# Altium project NFC-Reader.PrjPcb (part 7 of 11)
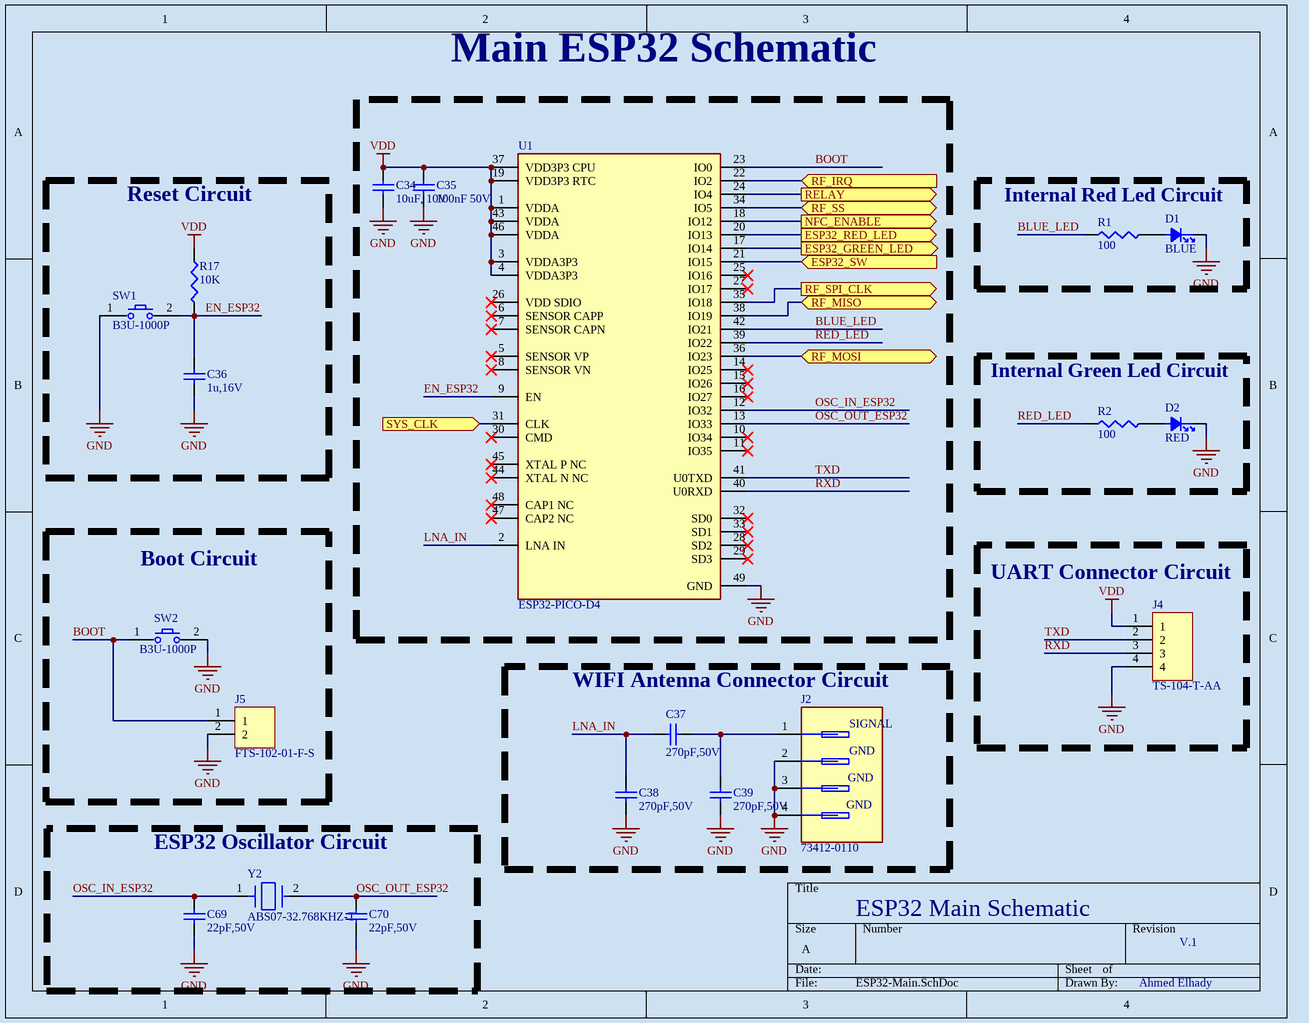
[diagram p10: ESP32-Main.SchDoc]

## Sheet ESP32-Main.SchDoc (continued)

### Library data of the parts (continued)
R1 R2 = CRCW0603100RFKEA: 100 Ohms ±1% 0.125W, 1/8W Chip Resistor 0603 (1608 Metric) Automotive AEC-Q200 Thick Film; Manufacturer: Vishay; Max Power Dissipation: 100mW; Value: 100Ω; Temperature Coefficient: 100ppm/°C; Voltage Rating: 75V; Supplier: DigiKey; Manufacturer Part Number: CRCW0603100RFKEA; RoHS: Compliant; Category: Chip SMD Resistors; Stock: 486492; Pricing: 1=0.1, 10=0.03, 25=0.0224, 50=0.0182, 100=0.015, 250=0.01172, 500=0.0099, 1000=0.00845 (USD); Case/Package: 0603; Case Code (Imperial): 0603; China RoHS: Non-Compliant; Composition: Thick Film; Contact Plating: Tin; Depth: 850µm; Features: Automotive AEC-Q200; Height: 450µm; Lead Free: Lead Free; Length: 1.55mm; Lifecycle Status: Production; Max Operating Temperature: 155°C; Military Standard: Not; Min Operating Temperature: -55°C; Mounting Technology: Surface Mount; Pins: 2; Number of Terminals: 2; Number of Terminations: 2; Packaging: Cut Tape; Power Dissipation: 100mW; Power Rating: 100mW; Radiation Hardening: No; REACH SVHC: Yes; Schedule B: 8533210045; Termination: SMD/SMT; Tolerance: 1%; Voltage Rating (DC): 75V; Weight: 2.012816mg; Width: 850µm; Working Voltage: 75V; ComponentLink1URL: https://datasheet.octopart.com:443/CRCW0603100RFKEA-Vishay-datasheet-175423584.pdf?src-supplier=Newark; ComponentLink1Description: https://datasheet.octopart.com:443/CRCW0603100RFKEA-Vishay-datasheet-175423584.pdf?src-supplier=Newark; ComponentLink2URL: https://datasheet.octopart.com:443/CRCW0603100RFKEA-Vishay-datasheet-14722531.pdf?src-supplier=Newark; ComponentLink2Description: https://datasheet.octopart.com:443/CRCW0603100RFKEA-Vishay-datasheet-14722531.pdf?src-supplier=Newark; ComponentLink3URL: https://datasheet.octopart.com:443/CRCW0603100RFKEA-Vishay-datasheet-11516975.pdf?src-supplier=Newark; ComponentLink3Description: https://datasheet.octopart.com:443/CRCW0603100RFKEA-Vishay-datasheet-11516975.pdf?src-supplier=Newark; ComponentLink4URL: https://datasheet.octopart.com:443/CRCW0603100RFKEA-Vishay-datasheet-41302739.pdf?src-supplier=Newark; ComponentLink4Description: https://datasheet.octopart.com:443/CRCW0603100RFKEA-Vishay-datasheet-41302739.pdf?src-supplier=Newark; ComponentLink5URL: https://datasheet.octopart.com:443/CRCW0603100RFKEA-Vishay-datasheet-33013972.pdf?src-supplier=Newark; ComponentLink5Description: https://datasheet.octopart.com:443/CRCW0603100RFKEA-Vishay-datasheet-33013972.pdf?src-supplier=Newark; ComponentLink6URL: https://datasheet.octopart.com:443/CRCW0603100RFKEA-Vishay-datasheet-21226360.pdf?src-supplier=Newark; ComponentLink6Description: https://datasheet.octopart.com:443/CRCW0603100RFKEA-Vishay-datasheet-21226360.pdf?src-supplier=Newark; ComponentLink7URL: https://datasheet.octopart.com:443/CRCW0603100RFKEA-Vishay-datasheet-62316122.pdf?src-supplier=Future+Electronics; ComponentLink7Description: https://datasheet.octopart.com:443/CRCW0603100RFKEA-Vishay-datasheet-62316122.pdf?src-supplier=Future+Electronics; ComponentLink8URL: https://datasheet.octopart.com:443/CRCW0603100RFKEA-Vishay-datasheet-5300368.pdf?src-supplier=Future+Electronics; ComponentLink8Description: https://datasheet.octopart.com:443/CRCW0603100RFKEA-Vishay-datasheet-5300368.pdf?src-supplier=Future+Electronics; ComponentLink9URL: https://datasheet.octopart.com:443/CRCW0603100RFKEA-Vishay-datasheet-83961561.pdf?src-supplier=element14+APAC; ComponentLink9Description: https://datasheet.octopart.com:443/CRCW0603100RFKEA-Vishay-datasheet-83961561.pdf?src-supplier=element14+APAC; ComponentLink10URL: https://datasheet.octopart.com:443/CRCW0603100RFKEA-Vishay-datasheet-62317933.pdf?src-supplier=element14+APAC; ComponentLink10Description: https://datasheet.octopart.com:443/CRCW0603100RFKEA-Vishay-datasheet-62317933.pdf?src-supplier=element14+APAC; ComponentLink11URL: https://datasheet.octopart.com:443/CRCW0603100RFKEA-Vishay-datasheet-16179825.pdf?src-supplier=element14+APAC; ComponentLink11Description: https://datasheet.octopart.com:443/CRCW0603100RFKEA-Vishay-datasheet-16179825.pdf?src-supplier=element14+APAC; ComponentLink12URL: https://datasheet.octopart.com:443/CRCW0603100RFKEA-Vishay-datasheet-66077789.pdf?src-supplier=element14+APAC; ComponentLink12Description: https://datasheet.octopart.com:443/CRCW0603100RFKEA-Vishay-datasheet-66077789.pdf?src-supplier=element14+APAC; ComponentLink13URL: https://datasheet.octopart.com:443/CRCW0603100RFKEA-Vishay-datasheet-5306405.pdf?src-supplier=RS+(Formerly+Allied+Electronics); ComponentLink13Description: https://datasheet.octopart.com:443/CRCW0603100RFKEA-Vishay-datasheet-5306405.pdf?src-supplier=RS+(Formerly+Allied+Electronics); ComponentLink14URL: https://datasheet.octopart.com:443/CRCW0603100RFKEA-Vishay-Dale-datasheet-47688880.pdf?src-supplier=RS+(Formerly+Allied+Electronics); ComponentLink14Description: https://datasheet.octopart.com:443/CRCW0603100RFKEA-Vishay-Dale-datasheet-47688880.pdf?src-supplier=RS+(Formerly+Allied+Electronics); ComponentLink15URL: https://datasheet.octopart.com:443/CRCW0603100RFKEA-Vishay-datasheet-12001583.pdf?src-supplier=RS+(Formerly+Allied+Electronics); ComponentLink15Description: https://datasheet.octopart.com:443/CRCW0603100RFKEA-Vishay-datasheet-12001583.pdf?src-supplier=RS+(Formerly+Allied+Electronics); ComponentLink16URL: https://datasheet.octopart.com:443/CRCW0603100RFKEA-Vishay-datasheet-137113732.pdf?src-supplier=X-ON; ComponentLink16Description: https://datasheet.octopart.com:443/CRCW0603100RFKEA-Vishay-datasheet-137113732.pdf?src-supplier=X-ON; ComponentLink17URL: https://datasheet.octopart.com:443/CRCW0603100RFKEA-Vishay-datasheet-17834126.pdf?src-supplier=TME; ComponentLink17Description: https://datasheet.octopart.com:443/CRCW0603100RFKEA-Vishay-datasheet-17834126.pdf?src-supplier=TME; ComponentLink18URL: https://datasheet.octopart.com/D-CRCW-e3-Standard-Thick-Film-Chip-Resistors-Vishay-datasheet-family-64.pdf; ComponentLink18Description: https://datasheet.octopart.com/D-CRCW-e3-Standard-Thick-Film-Chip-Resistors-Vishay-datasheet-family-64.pdf; ComponentLink19URL: https://datasheet.octopart.com:443/CRCW0603100RFKEA-Vishay-datasheet-13242068.pdf?src-supplier=Farnell; ComponentLink19Description: https://datasheet.octopart.com:443/CRCW0603100RFKEA-Vishay-datasheet-13242068.pdf?src-supplier=Farnell; ComponentLink20URL: https://datasheet.octopart.com:443/CRCW0603100RFKEA-Vishay-datasheet-13195083.pdf?src-supplier=Farnell; ComponentLink20Description: https://datasheet.octopart.com:443/CRCW0603100RFKEA-Vishay-datasheet-13195083.pdf?src-supplier=Farnell; ComponentLink21URL: https://datasheet.octopart.com:443/CRCW0603100RFKEA-Vishay-datasheet-13034211.pdf?src-supplier=Farnell; ComponentLink21Description: https://datasheet.octopart.com:443/CRCW0603100RFKEA-Vishay-datasheet-13034211.pdf?src-supplier=Farnell; ComponentLink22URL: https://datasheet.octopart.com:443/CRCW0603100RFKEA-Vishay-datasheet-12600034.pdf?src-supplier=Farnell; ComponentLink22Description: https://datasheet.octopart.com:443/CRCW0603100RFKEA-Vishay-datasheet-12600034.pdf?src-supplier=Farnell; ComponentLink23URL: https://datasheet.octopart.com:443/CRCW0603100RFKEA-Vishay-datasheet-12532161.pdf?src-supplier=Farnell; ComponentLink23Description: https://datasheet.octopart.com:443/CRCW0603100RFKEA-Vishay-datasheet-12532161.pdf?src-supplier=Farnell; ComponentLink24URL: https://datasheet.octopart.com:443/CRCW0603100RFKEA-Vishay-datasheet-12517896.pdf?src-supplier=Farnell; ComponentLink24Description: https://datasheet.octopart.com:443/CRCW0603100RFKEA-Vishay-datasheet-12517896.pdf?src-supplier=Farnell; ComponentLink25URL: https://datasheet.octopart.com:443/CRCW0603100RFKEA-Vishay-datasheet-12509762.pdf?src-supplier=Farnell; ComponentLink25Description: https://datasheet.octopart.com:443/CRCW0603100RFKEA-Vishay-datasheet-12509762.pdf?src-supplier=Farnell; ComponentLink26URL: https://datasheet.octopart.com:443/CRCW0603100RFKEA-Vishay-datasheet-10322335.pdf?src-supplier=Farnell; ComponentLink26Description: https://datasheet.octopart.com:443/CRCW0603100RFKEA-Vishay-datasheet-10322335.pdf?src-supplier=Farnell; ComponentLink27URL: https://datasheet.octopart.com:443/CRCW0603100RFKEA-Vishay-datasheet-8788789.pdf?src-supplier=Farnell; ComponentLink27Description: https://datasheet.octopart.com:443/CRCW0603100RFKEA-Vishay-datasheet-8788789.pdf?src-supplier=Farnell; ComponentLink28URL: https://datasheet.octopart.com:443/CRCW0603100RFKEA-Vishay-datasheet-8361388.pdf?src-supplier=Farnell; ComponentLink28Description: https://datasheet.octopart.com:443/CRCW0603100RFKEA-Vishay-datasheet-8361388.pdf?src-supplier=Farnell; ComponentLink29URL: https://datasheet.octopart.com:443/CRCW0603100RFKEA-Vishay-datasheet-546287.pdf?src-supplier=Farnell; ComponentLink29Description: https://datasheet.octopart.com:443/CRCW0603100RFKEA-Vishay-datasheet-546287.pdf?src-supplier=Farnell; ComponentLink30URL: https://datasheet.octopart.com:443/CRCW0603100RFKEA-Vishay-datasheet-11540273.pdf?src-supplier=Arrow+Electronics; ComponentLink30Description: https://datasheet.octopart.com:443/CRCW0603100RFKEA-Vishay-datasheet-11540273.pdf?src-supplier=Arrow+Electronics; ComponentLink31URL: https://datasheet.octopart.com:443/CRCW0603100RFKEA-Vishay-datasheet-8445837.pdf?src-supplier=element14; ComponentLink31Description: https://datasheet.octopart.com:443/CRCW0603100RFKEA-Vishay-datasheet-8445837.pdf?src-supplier=element14; ComponentLink32URL: https://datasheet.octopart.com:443/CRCW0603100RFKEA-Vishay-datasheet-5377433.pdf?src-supplier=Garrett; ComponentLink32Description: https://datasheet.octopart.com:443/CRCW0603100RFKEA-Vishay-datasheet-5377433.pdf?src-supplier=Garrett; ComponentLink33URL: https://datasheet.octopart.com:443/CRCW0603100RFKEA-Vishay-datasheet-148188.pdf?src-supplier=Garrett; ComponentLink33Description: https://datasheet.octopart.com:443/CRCW0603100RFKEA-Vishay-datasheet-148188.pdf?src-supplier=Garrett; ComponentLink34URL: https://datasheet.octopart.com:443/CRCW0603100RFKEA-Vishay-datasheet-30224.pdf?src-supplier=Garrett; ComponentLink34Description: https://datasheet.octopart.com:443/CRCW0603100RFKEA-Vishay-datasheet-30224.pdf?src-supplier=Garrett; ComponentLink35URL: http://sigma.octopart.com:80/rohs_certificate/D-CRCW-e3-Standard-Thick-Film-Chip-Resistors-Vishay-family-102.pdf?src-supplier=Compliance+Statements; ComponentLink35Description: http://sigma.octopart.com:80/rohs_certificate/D-CRCW-e3-Standard-Thick-Film-Chip-Resistors-Vishay-family-102.pdf?src-supplier=Compliance+Statements; LCSC PN: C844917
R17 = RC0603FR-0710KL: 10 kOhms ±1% 0.1W, 1/10W Chip Resistor 0603 (1608 Metric) Moisture Resistant Thick Film; Manufacturer: Yageo Group; Power Dissipation: 100mW; Value: 10kΩ; Temperature Coefficient: 100ppm/°C; Voltage Rating: 75V; Voltage Rating (DC): 50V; Supplier: DigiKey; Manufacturer Part Number: RC0603FR-0710KL; RoHS: Compliant; Category: Chip SMD Resistors; Stock: 14914136; Pricing: 1=0.1, 10=0.006, 25=0.0052 (USD); Case/Package: 0603; Case Code (Imperial): 0603; Case Code (Metric): 0603; China RoHS: Non-Compliant; Composition: Thick Film; Depth: 800µm; Height: 450µm; Lead Free: Lead Free; Lead Pitch: 300µm; Length: 1.6mm; Lifecycle Status: Production; Max Operating Temperature: 155°C; Military Standard: Not; Min Operating Temperature: -55°C; Mounting Technology: Surface Mount; Pins: 2; Number of Terminals: 2; Packaging: Tape & Reel; Power Rating: 100mW; REACH SVHC: Yes; Schedule B: 8533210045, 8533210045|8533210045|8533210045|8533210045|8533210045|8533210045|8533210045|8533210045|8533210045|8533210045|8533210045|8533210045|8533210045|8533210045|8533210045|8533210045|8533210045|8533210045|8533210045|8533210045|8533210045|8533210045|8533210045|85; Termination: SMD/SMT; Tolerance: 1%; Weight: 2.012816mg; Width: 800µm; Working Voltage: 75V; ComponentLink1URL: https://datasheet.octopart.com:443/RC0603FR-0710KL-Yageo-datasheet-175887523.pdf?src-supplier=IHS; ComponentLink1Description: https://datasheet.octopart.com:443/RC0603FR-0710KL-Yageo-datasheet-175887523.pdf?src-supplier=IHS; ComponentLink2URL: https://datasheet.octopart.com:443/RC0603FR-0710KL-Yageo-datasheet-103092701.pdf?src-supplier=Upverter; ComponentLink2Description: https://datasheet.octopart.com:443/RC0603FR-0710KL-Yageo-datasheet-103092701.pdf?src-supplier=Upverter; ComponentLink3URL: https://datasheet.octopart.com:443/RC0603FR-0710KL-Yageo-datasheet-98239111.pdf?src-supplier=Upverter; ComponentLink3Description: https://datasheet.octopart.com:443/RC0603FR-0710KL-Yageo-datasheet-98239111.pdf?src-supplier=Upverter; ComponentLink4URL: https://datasheet.octopart.com:443/RC0603FR-0710KL-Yageo-datasheet-141265859.pdf?src-supplier=Upverter; ComponentLink4Description: https://datasheet.octopart.com:443/RC0603FR-0710KL-Yageo-datasheet-141265859.pdf?src-supplier=Upverter; ComponentLink5URL: https://sigma.octopart.com:443/138820526/technical_drawing/Yageo-RC0603FR-0710KL.pdf?src-supplier=Upverter; ComponentLink5Description: https://sigma.octopart.com:443/138820526/technical_drawing/Yageo-RC0603FR-0710KL.pdf?src-supplier=Upverter; ComponentLink6URL: https://datasheet.octopart.com:443/RC0603FR-0710KL-Yageo-datasheet-8328172.pdf?src-supplier=Farnell; ComponentLink6Description: https://datasheet.octopart.com:443/RC0603FR-0710KL-Yageo-datasheet-8328172.pdf?src-supplier=Farnell; ComponentLink7URL: https://datasheet.octopart.com:443/RC0603FR-0710KL-Yageo-datasheet-13691069.pdf?src-supplier=Farnell; ComponentLink7Description: https://datasheet.octopart.com:443/RC0603FR-0710KL-Yageo-datasheet-13691069.pdf?src-supplier=Farnell; ComponentLink8URL: https://datasheet.octopart.com:443/RC0603FR-0710KL-Yageo-datasheet-62067350.pdf?src-supplier=element14+APAC; ComponentLink8Description: https://datasheet.octopart.com:443/RC0603FR-0710KL-Yageo-datasheet-62067350.pdf?src-supplier=element14+APAC; ComponentLink9URL: https://datasheet.octopart.com:443/RC0603FR-0710KL-Yageo-datasheet-17842380.pdf?src-supplier=element14+APAC; ComponentLink9Description: https://datasheet.octopart.com:443/RC0603FR-0710KL-Yageo-datasheet-17842380.pdf?src-supplier=element14+APAC; ComponentLink10URL: https://datasheet.octopart.com:443/RC0603FR-0710KL-Yageo-datasheet-15599030.pdf?src-supplier=Future+Electronics; ComponentLink10Description: https://datasheet.octopart.com:443/RC0603FR-0710KL-Yageo-datasheet-15599030.pdf?src-supplier=Future+Electronics; ComponentLink11URL: https://datasheet.octopart.com:443/RC0603FR-0710KL-Yageo-datasheet-164759695.pdf?src-supplier=Future+Electronics; ComponentLink11Description: https://datasheet.octopart.com:443/RC0603FR-0710KL-Yageo-datasheet-164759695.pdf?src-supplier=Future+Electronics; ComponentLink12URL: https://datasheet.octopart.com:443/RC0603FR-0710KL-Yageo-datasheet-127823281.pdf?src-supplier=Future+Electronics; ComponentLink12Description: https://datasheet.octopart.com:443/RC0603FR-0710KL-Yageo-datasheet-127823281.pdf?src-supplier=Future+Electronics; ComponentLink13URL: https://datasheet.octopart.com:443/RC0603FR-0710KL-Yageo-datasheet-137700087.pdf?src-supplier=Future+Electronics; ComponentLink13Description: https://datasheet.octopart.com:443/RC0603FR-0710KL-Yageo-datasheet-137700087.pdf?src-supplier=Future+Electronics; ComponentLink14URL: https://datasheet.octopart.com:443/RC0603FR-0710KL-Yageo-datasheet-27584510.pdf?src-supplier=Future+Electronics; ComponentLink14Description: https://datasheet.octopart.com:443/RC0603FR-0710KL-Yageo-datasheet-27584510.pdf?src-supplier=Future+Electronics; ComponentLink15URL: https://datasheet.octopart.com:443/RC0603FR-0710KL-Yageo-datasheet-8324193.pdf?src-supplier=Future+Electronics; ComponentLink15Description: https://datasheet.octopart.com:443/RC0603FR-0710KL-Yageo-datasheet-8324193.pdf?src-supplier=Future+Electronics; ComponentLink16URL: https://datasheet.octopart.com:443/RC0603FR-0710KL-Yageo-datasheet-12596169.pdf?src-supplier=Newark; ComponentLink16Description: https://datasheet.octopart.com:443/RC0603FR-0710KL-Yageo-datasheet-12596169.pdf?src-supplier=Newark; ComponentLink17URL: https://datasheet.octopart.com:443/RC0603FR-0710KL-Yageo-datasheet-503470.pdf?src-supplier=Newark; ComponentLink17Description: https://datasheet.octopart.com:443/RC0603FR-0710KL-Yageo-datasheet-503470.pdf?src-supplier=Newark; ComponentLink18URL: https://datasheet.octopart.com:443/RC0603FR-0710KL-Yageo-datasheet-34211833.pdf?src-supplier=Newark; ComponentLink18Description: https://datasheet.octopart.com:443/RC0603FR-0710KL-Yageo-datasheet-34211833.pdf?src-supplier=Newark; ComponentLink19URL: https://datasheet.octopart.com:443/RC0603FR-0710KL-Yageo-datasheet-79472498.pdf?src-supplier=Megastar; ComponentLink19Description: https://datasheet.octopart.com:443/RC0603FR-0710KL-Yageo-datasheet-79472498.pdf?src-supplier=Megastar; ComponentLink20URL: https://datasheet.octopart.com/RC0603FR-0710KL-Yageo-datasheet-73766026.pdf; ComponentLink20Description: https://datasheet.octopart.com/RC0603FR-0710KL-Yageo-datasheet-73766026.pdf; ComponentLink21URL: https://datasheet.octopart.com:443/RC0603FR-0710KL-Yageo-datasheet-118562.pdf?src-supplier=DigiKey; ComponentLink21Description: https://datasheet.octopart.com:443/RC0603FR-0710KL-Yageo-datasheet-118562.pdf?src-supplier=DigiKey; ComponentLink22URL: http://sigma.octopart.com:80/rohs_statement/Yageo-company-2.pdf?src-supplier=Compliance+Statements; ComponentLink22Description: http://sigma.octopart.com:80/rohs_statement/Yageo-company-2.pdf?src-supplier=Compliance+Statements; ComponentLink23URL: http://sigma.octopart.com:80/conflict_mineral_statement/Yageo-company-3.pdf?src-supplier=Compliance+Statements; ComponentLink23Description: http://sigma.octopart.com:80/conflict_mineral_statement/Yageo-company-3.pdf?src-supplier=Compliance+Statements; LCSC PN: C98220
SW1 SW2 = B3U-1000P: Switch Tactile N.O. SPST Round Button Solder Tab 12VDC 50mA 200000Cycles 1.5N SMD Emboss T/R; Manufacturer: Omron; Manufacturer Package Identifier: B3U-1000P(M); Actuator Length: 400µm; Contact Resistance: 100mΩ; Electrical Life: 200kcycles; Illumination Type: Illuminated, Non-Illuminated; Max Voltage Rating (DC): 12V; Number of Positions: 1; Operating Force: 1.99N; Ratings: Dust Proof, IP40; Sealable: DUST PROOF; Switch Function: Off-Mom; Switch Travel: 150µm; Supplier: DigiKey; Manufacturer Part Number: B3U-1000P; RoHS: Compliant; Category: Tactile Switches; Stock: 62631; Pricing: 1=0.94, 10=0.759, 25=0.7368, 100=0.6909, 250=0.63796, 500=0.57526, 1000=0.57268, 3500=0.54684, 7000=0.54096, 10500=0.5099 (USD); Ambient Temperature Range High: 70°C; Color: Silver; Contact Current Rating: 50mA; Contact Material: Silver; Contact Plating: Silver; Current Rating: 50mA; Depth: 2.5mm; Height: 1.2mm; Insulation Resistance: 100MΩ; Lead Free: Lead Free; Length: 3mm; Life (Cycles): 200kcycles; Lifecycle Status: Production; Max Current Rating: 50mA; Max Operating Temperature: 70°C; Mechanical Life: 200kcycles; Min Operating Temperature: -25°C; Mounting Technology: Surface Mount; Pins: 2; Packaging: Tape and Reel; REACH SVHC: Yes; Termination: SMD/SMT; Throw Configuration: SPST; Voltage Rating (DC): 12V; Weight: 21.99923mg; Width: 2.5mm; ComponentLink1URL: https://datasheet.octopart.com:443/B3U-1000P-Omron-datasheet-62106914.pdf?src-supplier=IHS; ComponentLink1Description: https://datasheet.octopart.com:443/B3U-1000P-Omron-datasheet-62106914.pdf?src-supplier=IHS; ComponentLink2URL: https://datasheet.octopart.com:443/B3U-1000P-Omron-datasheet-10910421.pdf?src-supplier=RS+(Formerly+Allied+Electronics); ComponentLink2Description: https://datasheet.octopart.com:443/B3U-1000P-Omron-datasheet-10910421.pdf?src-supplier=RS+(Formerly+Allied+Electronics); ComponentLink3URL: https://datasheet.octopart.com:443/B3U-1000P-Omron-datasheet-5458533.pdf?src-supplier=Upverter; ComponentLink3Description: https://datasheet.octopart.com:443/B3U-1000P-Omron-datasheet-5458533.pdf?src-supplier=Upverter; ComponentLink4URL: https://datasheet.octopart.com:443/B3U-1000P-Omron-datasheet-11968313.pdf?src-supplier=SOS+electronic; ComponentLink4Description: https://datasheet.octopart.com:443/B3U-1000P-Omron-datasheet-11968313.pdf?src-supplier=SOS+electronic; ComponentLink5URL: https://datasheet.octopart.com:443/B3U-1000P-Omron-datasheet-110759174.pdf?src-supplier=Newark; ComponentLink5Description: https://datasheet.octopart.com:443/B3U-1000P-Omron-datasheet-110759174.pdf?src-supplier=Newark; ComponentLink6URL: https://datasheet.octopart.com:443/B3U-1000P-Omron-datasheet-506776.pdf?src-supplier=Newark; ComponentLink6Description: https://datasheet.octopart.com:443/B3U-1000P-Omron-datasheet-506776.pdf?src-supplier=Newark; ComponentLink7URL: https://datasheet.octopart.com:443/B3U-1000P-Omron-datasheet-17589256.pdf?src-supplier=TME; ComponentLink7Description: https://datasheet.octopart.com:443/B3U-1000P-Omron-datasheet-17589256.pdf?src-supplier=TME; LCSC PN: C231329
U1 = ESP32-PICO-D4: Bluetooth, WiFi 802.11b/g/n, Bluetooth v4.2 +EDR, Class 1, 2 and 3 Transceiver Module 2.4GHz ~ 2.5GHz Surface Mount; Manufacturer: Espressif Systems; Bandwidth: 72MHz; Data Rate: 150mbps; Interface: I2C, I2S, SPI, UART; Clock Frequency: 2.484GHz; Max Supply Voltage: 3.6V; Min Supply Voltage: 3V; Nominal Supply Current: 80mA; Number of ADC Channels: 18; Number of Circuits: 1; Number of GPIO: 22; Operating Supply Voltage: 3.3V; Supplier: DigiKey; Manufacturer Part Number: ESP32-PICO-D4; RoHS: Compliant; Category: RF Receivers, Transceivers; Stock: 4731; Pricing: 1=6.79, 10=5.885, 25=5.5696, 100=5.1367, 250=4.87732, 500=4.69424, 1000=4.52173, 2000=4.50003 (USD); Height: 1.04mm; Height - Seated (Max): 1.04mm; Length: 7mm; Max Operating Temperature: 85°C; Manufacturer Package Identifier: ESP32-PICO-D4; Min Operating Temperature: -40°C; Number of Terminals: 48; Terminal Pitch: 500µm; Width: 7mm; ComponentLink1URL: https://datasheet.octopart.com:443/ESP32-PICO-D4-Espressif-Systems-datasheet-138896082.pdf?src-supplier=IHS; ComponentLink1Description: https://datasheet.octopart.com:443/ESP32-PICO-D4-Espressif-Systems-datasheet-138896082.pdf?src-supplier=IHS; ComponentLink2URL: https://datasheet.octopart.com:443/ESP32-PICO-D4-Espressif-Systems-datasheet-188867343.pdf?src-supplier=TME; ComponentLink2Description: https://datasheet.octopart.com:443/ESP32-PICO-D4-Espressif-Systems-datasheet-188867343.pdf?src-supplier=TME; ComponentLink3URL: https://datasheet.octopart.com:443/ESP32-PICO-D4-Espressif-Systems-datasheet-165560559.pdf?src-supplier=TME; ComponentLink3Description: https://datasheet.octopart.com:443/ESP32-PICO-D4-Espressif-Systems-datasheet-165560559.pdf?src-supplier=TME; ComponentLink4URL: https://datasheet.octopart.com:443/ESP32-PICO-D4-Espressif-Systems-datasheet-109841465.pdf?src-supplier=TME; ComponentLink4Description: https://datasheet.octopart.com:443/ESP32-PICO-D4-Espressif-Systems-datasheet-109841465.pdf?src-supplier=TME; LCSC PN: C193707
Y2 = ABS07-32.768KHZ-T: 32.768 kHz ±20ppm Crystal 12.5pF 70 kOhms 2-SMD, No Lead; Manufacturer: Abracon; ESR (Equivalent Series Resistance): 70kΩ; Frequency Stability: 144ppm; Frequency Tolerance: 0.002%; Supplier: DigiKey; Manufacturer Part Number: ABS07-32.768KHZ-T; RoHS: Compliant; Category: Crystals; Stock: 949488; Pricing: 1=0.61, 10=0.528, 25=0.4996, 50=0.4788, 100=0.4591, 250=0.43416, 500=0.41618, 1000=0.39896 (USD); Value: 12.5pF; Case/Package: CSMD; China RoHS: Compliant; Depth: 1.5mm; Frequency: 32.768kHz; Height: 900µm; Lead Free: Lead Free; Length: 3.2mm; Lifecycle Status: Production; Load Capacitance: 12.5pF; Max Operating Temperature: 85°C; Min Operating Temperature: -40°C; Mounting Technology: Surface Mount; Pins: 2; Packaging: Tape and Reel; Radiation Hardening: No; REACH SVHC: Yes; Schedule B: 8541600025, 8541600025|8541600025, 8541600025|8541600025|8541600025, 8541600025|8541600025|8541600025|8541600025; ESR: 70kΩ; Termination: SMD/SMT; Tolerance: 0.002%; Width: 1.5494mm; ComponentLink1URL: https://datasheet.octopart.com:443/ABS07-32.768KHZ-T-Abracon-datasheet-166693031.pdf?src-supplier=Master+Electronics; ComponentLink1Description: https://datasheet.octopart.com:443/ABS07-32.768KHZ-T-Abracon-datasheet-166693031.pdf?src-supplier=Master+Electronics; ComponentLink2URL: https://datasheet.octopart.com:443/ABS07-32.768KHZ-T-Abracon-datasheet-103422647.pdf?src-supplier=JRH+Electronics; ComponentLink2Description: https://datasheet.octopart.com:443/ABS07-32.768KHZ-T-Abracon-datasheet-103422647.pdf?src-supplier=JRH+Electronics; ComponentLink3URL: https://datasheet.octopart.com:443/ABS07-32.768KHZ-T-Abracon-datasheet-12512028.pdf?src-supplier=Upverter; ComponentLink3Description: https://datasheet.octopart.com:443/ABS07-32.768KHZ-T-Abracon-datasheet-12512028.pdf?src-supplier=Upverter; ComponentLink4URL: https://datasheet.octopart.com:443/ABS07-32.768KHZ-T-Abracon-datasheet-10031075.pdf?src-supplier=Upverter; ComponentLink4Description: https://datasheet.octopart.com:443/ABS07-32.768KHZ-T-Abracon-datasheet-10031075.pdf?src-supplier=Upverter; ComponentLink5URL: https://datasheet.octopart.com:443/ABS07-32.768KHZ-T-Abracon-datasheet-8326266.pdf?src-supplier=Upverter; ComponentLink5Description: https://datasheet.octopart.com:443/ABS07-32.768KHZ-T-Abracon-datasheet-8326266.pdf?src-supplier=Upverter; ComponentLink6URL: https://datasheet.octopart.com:443/ABS07-32.768KHZ-T-Abracon-datasheet-121082.pdf?src-supplier=Upverter; ComponentLink6Description: https://datasheet.octopart.com:443/ABS07-32.768KHZ-T-Abracon-datasheet-121082.pdf?src-supplier=Upverter; ComponentLink7URL: https://datasheet.octopart.com:443/ABS07-32.768KHZ-T-Abracon-datasheet-41191559.pdf?src-supplier=element14+APAC; ComponentLink7Description: https://datasheet.octopart.com:443/ABS07-32.768KHZ-T-Abracon-datasheet-41191559.pdf?src-supplier=element14+APAC; ComponentLink8URL: https://datasheet.octopart.com:443/ABS07-32.768KHZ-T-Abracon-datasheet-15206620.pdf?src-supplier=Newark; ComponentLink8Description: https://datasheet.octopart.com:443/ABS07-32.768KHZ-T-Abracon-datasheet-15206620.pdf?src-supplier=Newark; ComponentLink9URL: https://datasheet.octopart.com:443/ABS07-32.768KHZ-T-Abracon-datasheet-37124839.pdf?src-supplier=Farnell; ComponentLink9Description: https://datasheet.octopart.com:443/ABS07-32.768KHZ-T-Abracon-datasheet-37124839.pdf?src-supplier=Farnell; ComponentLink10URL: https://datasheet.octopart.com:443/ABS07-32.768KHZ-T-Abracon-datasheet-128558976.pdf?src-supplier=X-ON; ComponentLink10Description: https://datasheet.octopart.com:443/ABS07-32.768KHZ-T-Abracon-datasheet-128558976.pdf?src-supplier=X-ON; ComponentLink11URL: https://datasheet.octopart.com:443/ABS07-32.768KHZ-T-Abracon-datasheet-49826663.pdf?src-supplier=TME; ComponentLink11Description: https://datasheet.octopart.com:443/ABS07-32.768KHZ-T-Abracon-datasheet-49826663.pdf?src-supplier=TME; ComponentLink12URL: https://datasheet.octopart.com:443/ABS07-32.768KHZ-T-Abracon-datasheet-15994676.pdf?src-supplier=TME; ComponentLink12Description: https://datasheet.octopart.com:443/ABS07-32.768KHZ-T-Abracon-datasheet-15994676.pdf?src-supplier=TME; ComponentLink13URL: http://sigma.octopart.com:80/conflict_mineral_statement/Abracon-company-27.pdf?src-supplier=Compliance+Statements; ComponentLink13Description: http://sigma.octopart.com:80/conflict_mineral_statement/Abracon-company-27.pdf?src-supplier=Compliance+Statements; LCSC PN: C130253

## Sheet RFID-Reader.SchDoc
size A; SheetNumber: 4; SheetTotal: 5
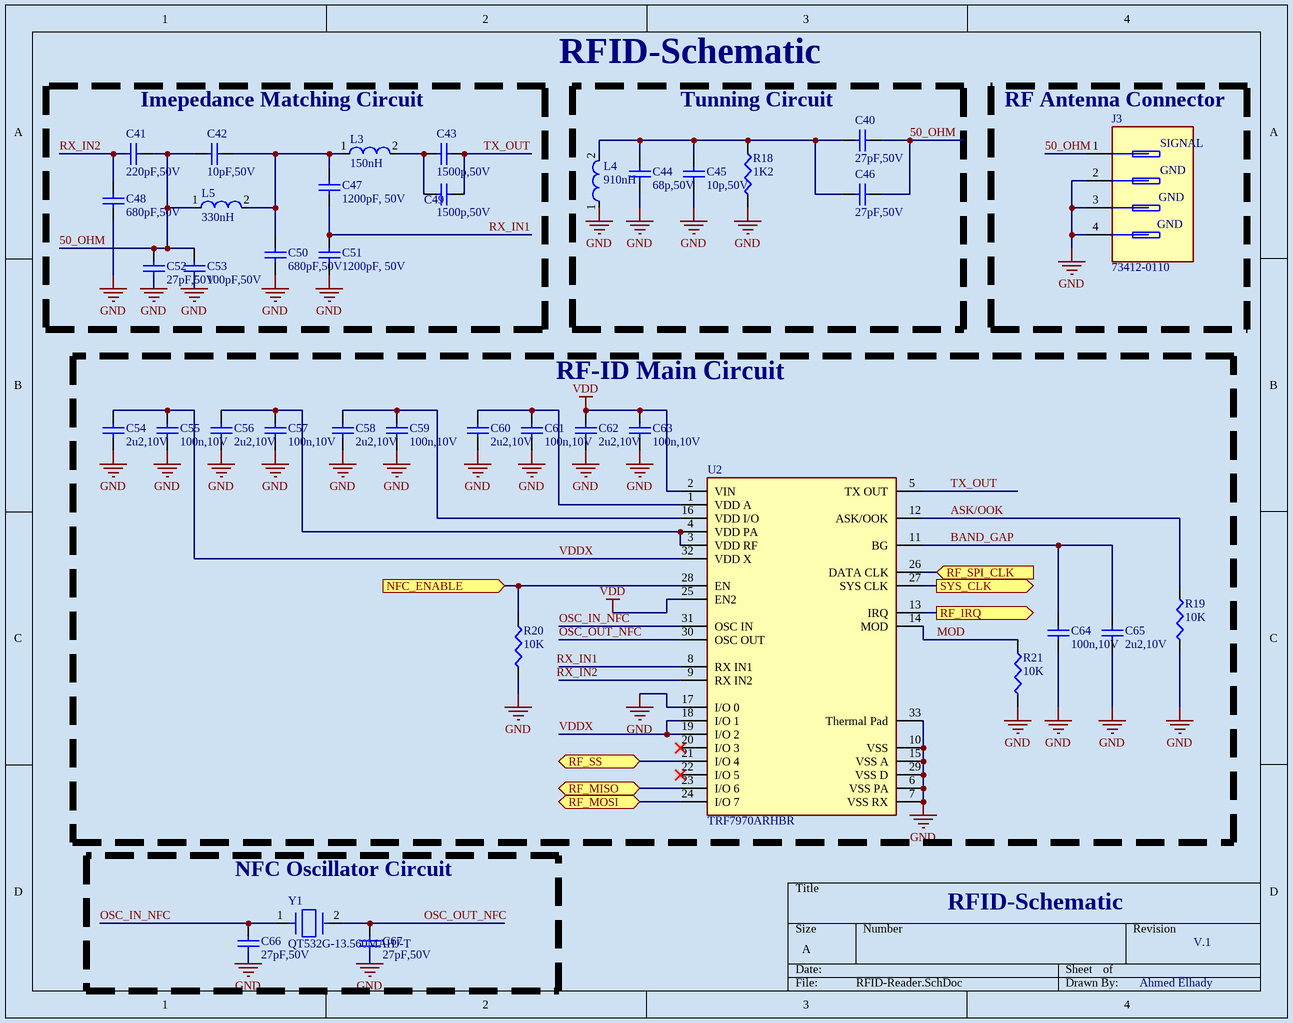
[diagram p3: RFID-Reader.SchDoc]

### Parts
C40  27pF,50V  [C0402-27pf-50V]
C41  220pF,50V  [220pf-50v-0402-yageo-CAPC1005X55N]
C42  10pF,50V  [YAGEO_10pf-50v-CC0402JRNPO9BN100_0]
C43  1500p,50V  [C0402-1500pF-Murata_GRM15_MFG]
C44  68p,50V  [TDK_C1005-68pf-50v]
C45  10p,50V  [YAGEO_10pf-50v-CC0402JRNPO9BN100_0]
C46  27pF,50V  [C0402-27pf-50V]
C47  1200pF, 50V  [1200F-50V-0402-Murata_GRM15_MFG]
C48  680pF,50V  [Kemet_C0402-680PF-50]
C49  1500p,50V  [C0402-1500pF-Murata_GRM15_MFG]
C50  680pF,50V  [Kemet_C0402-680PF-50]
C51  1200pF, 50V  [1200F-50V-0402-Murata_GRM15_MFG]
C52  27pF,50V  [C0402-27pf-50V]
C53  100pF,50V  [100pf-50v-0402-Murata_GRM15_MFG]
C54  2u2,10V  [C0402-2.2u-10V-Murata_GRM155-0_2_MFG]
C55  100n,10V  [C0402-100nF-10V]
C56  2u2,10V  [C0402-2.2u-10V-Murata_GRM155-0_2_MFG]
C57  100n,10V  [C0402-100nF-10V]
C58  2u2,10V  [C0402-2.2u-10V-Murata_GRM155-0_2_MFG]
C59  100n,10V  [C0402-100nF-10V]
C60  2u2,10V  [C0402-2.2u-10V-Murata_GRM155-0_2_MFG]
C61  100n,10V  [C0402-100nF-10V]
C62  2u2,10V  [C0402-2.2u-10V-Murata_GRM155-0_2_MFG]
C63  100n,10V  [C0402-100nF-10V]
C64  100n,10V  [C0402-100nF-10V]
C65  2u2,10V  [C0402-2.2u-10V-Murata_GRM155-0_2_MFG]
C66  27pF,50V  [C0402-27pf-50V]
C67  27pF,50V  [C0402-27pf-50V]
J3  73412-0110  [ANT_CONN_Molex_734-12-0110_0]
L3  150nH  [150nH-SMD2]
L4  910nH  [COIL_910nH_SMD]
L5  330nH  [330nh-SMD2]
R18  1K2  [RESC1005X40N-1.2k]
R19  10K  [YAGEO-0603-10K-0.1W]
R20  10K  [YAGEO-0603-10K-0.1W]
R21  10K  [YAGEO-0603-10K-0.1W]
U2  TRF7970ARHBR  [NFC_FP_TRF7970ARHBR]
Y1  QT532G-13.560MAHJ-T  [Crystal-13.56 MHz]

### Blocks framed on the sheet
Imepedance Matching Circuit: C41-C43 C47-C53 L3 L5
Tunning Circuit: C40 C44-C46 L4 R18
RF Antenna Connector: J3
RF-ID Main Circuit: C54-C65 R19-R21 U2
NFC Oscillator Circuit: C66 C67 Y1

### Ports
NFC_ENABLE (in, see Main Block Diagram[3C], ESP32-Main[3A]), RF_IRQ (out, see Main Block Diagram[3C], ESP32-Main[3A]), RF_MISO (bidir, see Main Block Diagram[3C], ESP32-Main[3B]), RF_MOSI (bidir, see Main Block Diagram[3C], ESP32-Main[3B]), RF_SPI_CLK (in, see Main Block Diagram[3C], ESP32-Main[3B]), RF_SS (bidir, see Main Block Diagram[3C], ESP32-Main[3A]), SYS_CLK (out, see Main Block Diagram[3C], ESP32-Main[2B])

### Nets
GND: C44.1 C45.2 C48.1 C50.1 C51.1 C52.1 C53.1 C54.1 C55.1 C56.1 C57.1 C58.1 C59.1 C60.1 C61.1 C62.1 C63.1 C64.1 C65.1 C66.1 C67.1 J3.2(GROUND) J3.3(GROUND) J3.4(GROUND) L4.1 R18.1 R19.1 R20.1 R21.1 U2.6(VSS_PA) U2.7(VSS_RX) U2.10(VSS) U2.15(VSS_A) U2.17(I/O_0) U2.29(VSS_D) U2.33(Thermal_Pad)
VDD: C62.2 C63.2 U2.2(VIN) U2.25(EN2)
50_OHM: C40.2 C41.1 C42.1 C46.2 C52.2 C53.2 J3.1(SIGNAL) L5.1
ASK/OOK: R19.2 U2.12(ASK/OOK)
BAND_GAP: C64.2 C65.2 U2.11(BG)
MOD: R21.2 U2.14(MOD)
NFC_ENABLE: R20.2 U2.28(EN) ; port NFC_ENABLE
OSC_IN_NFC: C66.2 U2.31(OSC_IN) Y1.1
OSC_OUT_NFC: C67.2 U2.30(OSC_OUT) Y1.2
RF_IRQ: U2.13(IRQ) ; port RF_IRQ
RF_MISO: U2.23(I/O_6) ; port RF_MISO
RF_MOSI: U2.24(I/O_7) ; port RF_MOSI
RF_SPI_CLK: U2.26(DATA_CLK) ; port RF_SPI_CLK
RF_SS: U2.21(I/O_4) ; port RF_SS
RX_IN1: C47.1 C51.2 U2.8(RX_IN1)
RX_IN2: C41.2 C48.2 U2.9(RX_IN2)
SYS_CLK: U2.27(SYS_CLK) ; port SYS_CLK
TX_OUT: C43.2 C49.2 U2.5(TX_OUT)
VDDX: C54.2 C55.2 U2.18(I/O_1) U2.19(I/O_2) U2.32(VDD_X)
NetC40_1: C40.1 C44.2 C45.1 C46.1 L4.2 R18.2
NetC42_2: C42.2 C47.2 C50.2 L3.1 L5.2
NetC43_1: C43.1 C49.1 L3.2
NetC56_2: C56.2 C57.2 U2.3(VDD_RF) U2.4(VDD_PA)
NetC58_2: C58.2 C59.2 U2.16(VDD_I/O)
NetC60_2: C60.2 C61.2 U2.1(VDD_A)

Not connected (* = marked no-connect by the designer): U2 20(I/O_3)* 22(I/O_5)*

### Notes on the sheet
- RFID-Schematic
- V.1
- Ahmed Elhady
- (in symbol 73412-0110) GND